# Altium schematic sheet VL53L1X.SchDoc
size A4; SheetNumber: 5; SheetTotal: 7
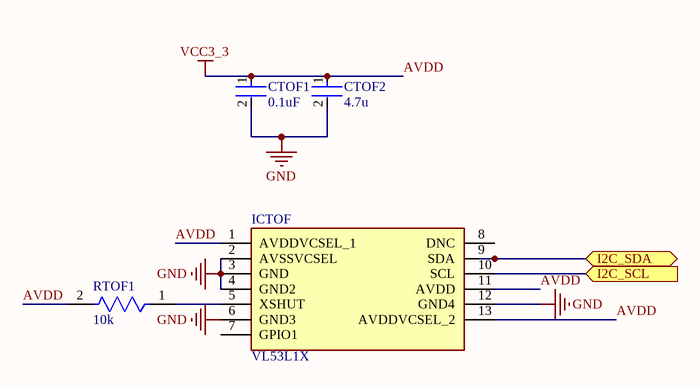
[diagram p0: VL53L1X.SchDoc]

## Parts
CTOF1  0.1uF  [FP-CL10-IPC_C]
CTOF2  4.7u  [FP-CL10-IPC_C]
ICTOF  VL53L1X  [VL53L1X]
RTOF1  10k  [FP-ERJ3G-IPC_C]

## Ports
I2C_SCL (in), I2C_SDA (bidir)

## Nets
AVDD: CTOF1.1 CTOF2.1 ICTOF.1(AVDDVCSEL_1) ICTOF.11(AVDD) ICTOF.13(AVDDVCSEL_2) RTOF1.2  [also labelled VCC3_3]
GND: CTOF1.2 CTOF2.2 ICTOF.2(AVSSVCSEL) ICTOF.3(GND) ICTOF.4(GND2) ICTOF.6(GND3) ICTOF.12(GND4)
I2C_SCL: ICTOF.10(SCL) ; port I2C_SCL
I2C_SDA: ICTOF.9(SDA) ; port I2C_SDA
NetICTOF_5: ICTOF.5(XSHUT) RTOF1.1

Not connected (* = marked no-connect by the designer): ICTOF 7(GPIO1) 8(DNC)

## Library data of the parts
CTOF1 = CMP-13271-001724-1: Cap Ceramic 100nF 50V X7R ±20% Pad SMD 0603 +125°C T/R; Mount: Surface Mount; Lead Free: Lead Free; Max Operating Temperature: 125°C; Voltage Rating: 50V; Case Code (Imperial): 0603; Capacitance: 100nF; Height: 0.8mm; Length: 1.6mm; Tolerance: 20%; Case Code (Metric): 1608; Thickness: 0.035inch; Depth: 0.8mm; Width: 0.031inch; Package Quantity: 1; Min Operating Temperature: -55°C; Case/Package: 0603; Radiation Hardening: No; Voltage Rating (DC): 50V; Dielectric: X7R; Packaging: Tape and Reel
CTOF2 = CMP-13271-003017-1: Cap Ceramic 4.7uF 10V X5R ±10% Pad SMD 0603 +85°C T/R; Capacitance: 4.7uF; Case/Package: 0603; Packaging: Tape and Reel; Width: 0.031inch; Contact Plating: Tin; Thickness: 0.035inch; Package Quantity: 1; Voltage Rating: 10V; Case Code (Metric): 1608; Case Code (Imperial): 0603; Depth: 0.8mm; Height: 0.8mm; Tolerance: 10%; Max Operating Temperature: 85°C; Length: 1.6mm; Dielectric: X5R; Mount: Surface Mount; Radiation Hardening: No; Min Operating Temperature: -55°C
ICTOF = CMP-006-000005-1: Integrated Circuit; Manufacturer_Name: STMicroelectronics; Datasheet Link: https://www.st.com/resource/en/datasheet/vl53l1x.pdf; Source: SamacSys.SchLib; Manufacturer_Part_Number: VL53L1X; Height: 1.6mm; Design Item ID: VL53L1X
RTOF1 = CMP-2000-00704-2: RES SMD 10K OHM 5% 1/10W 0603; Temperature Coefficient: 200ppm/°C; Max Power Dissipation: 100mW; Resistance: 10kR; Voltage Rating (DC): 50V; Voltage Rating: 75V; Resistor Type: Thick Film; Tolerance: 5%; Military Standard: Not; Package Quantity: 1; Max Operating Temperature: 155°C; Mount: Surface Mount; Technology: THICK FILM; Case/Package: 0603; Construction: Rectangular; Depth: 0.8mm; Case Code (Imperial): 0603; Weight: 7.1E-05oz; Features: Automotive AEC-Q200; Packaging: Tape and Reel; Width: 0.8mm; Length: 1.6mm; Termination: SMD/SMT; Power Rating: 100mW; Lead Free: Lead Free; Number of Terminations: 2; Height: 0.45mm; RoHS Compliant: Yes; Min Operating Temperature: -55°C; Contact Plating: Tin; REACH SVHC: No SVHC; Resistance Tolerance: 5%; Series: ERJ; Working Voltage: 75V; Case Code (Metric): 1608